# EAGLE schematic Driver (EAGLE 7.2.0)
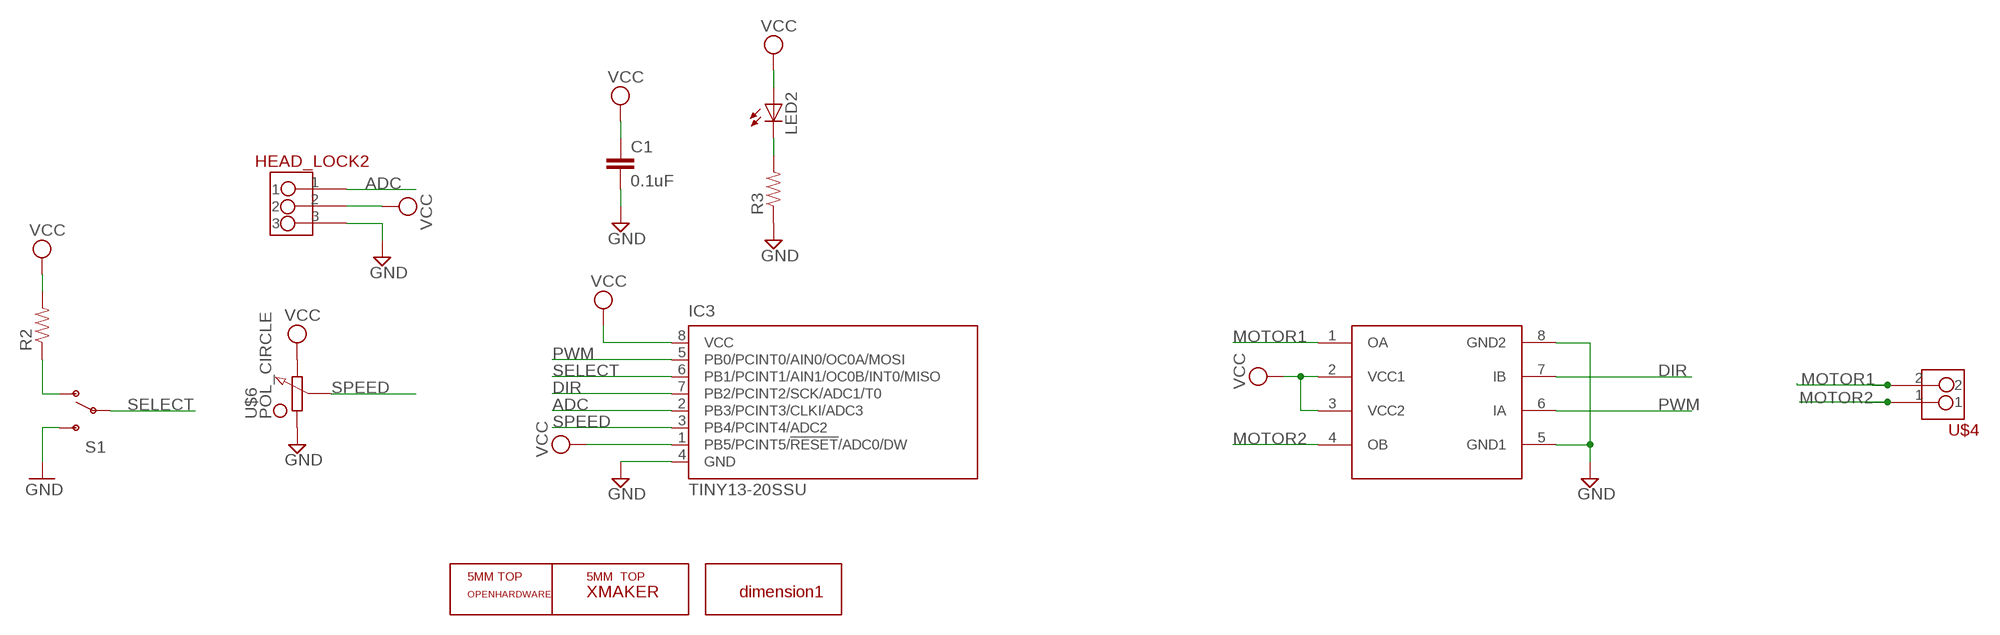
[diagram p0: schematic, sheet 1]

## Parts
C1  0.1uF  CAP0603-CAP  [0603-CAP]
HEAD_LOCK2  HEAD_LOCK  [HEAD_LOCK]
IC3  TINY13-20SSU  [8S1]
LED2  LED_ESML0603  [LED_SML0603]
R2  RESISTOR0603-RES  [0603-RES]
R3  0.27OHM-1/10W-1%(0603)  [0603-RES]
S1  SWITCH-SPDTKIT  [SWITCH-SPDT_KIT]
U$1  DIMENSION1  [DIMENSION1]
U$2  L9110  [SOP8]
U$4  HEAD_LOCK2  [HEAD_LOCK2]
U$6  POL_CIRCLE  [POT_CIRCLE]
U$7  XMAKERLOGO_5MM_TOP  [XMAKERLOGO_5MM_TOP]
U$8  OPENHARDWARE_5MM_TOP  [OPENSOURCE_5MM_TOP]

## Nets
ADC: HEAD_LOCK2.1 IC3.2(PB3/PCINT3/CLKI/ADC3)
DIR: IC3.7(PB2/PCINT2/SCK/ADC1/T0) U$2.7(IB)
GND: C1.2 HEAD_LOCK2.3 IC3.4(GND) R3.1 S1.3(S) U$2.5(GND1) U$2.8(GND2) U$6.P$3
MOTOR1: U$2.1(OA) U$4.2
MOTOR2: U$2.4(OB) U$4.1
N$2: R2.1 S1.1(O)
N$5: LED2.C R3.2
PWM: IC3.5(PB0/PCINT0/AIN0/OC0A/MOSI) U$2.6(IA)
SELECT: IC3.6(PB1/PCINT1/AIN1/OC0B/INT0/MISO) S1.2(P)
SPEED: IC3.3(PB4/PCINT4/ADC2) U$6.P$2
VCC: C1.1 HEAD_LOCK2.2 IC3.1(PB5/PCINT5/!RESET!/ADC0/DW) IC3.8(VCC) LED2.A R2.2 U$2.2(VCC1) U$2.3(VCC2) U$6.P$1

## Library data of the parts
C1 = SparkFun-Passives:CAP: Capacitor Standard 0603 ceramic capacitor, and 0.1" leaded capacitor.
HEAD_LOCK2 = Xmaker:HEAD_LOCK
IC3 = atmel:TINY13: 8-bit AVR Microcontroller with 1K Bytes In-System Programmable Flash Source: http://www.atmel.com/dyn/resources/prod_documents/2535S.pdf; MPN: ATTINY13-20SSU; OC_FARNELL: 1455133; OC_NEWARK: 58M3771
LED2 = eagle-ltspice:LED_E: LED Source: http://www.osram.convergy.de Source: www.luxeon.com Source: www.kingbright.com; SPICEMODEL: NONE; SPICEPREFIX: D; SPICETYPE: diode
R2 = SparkFun-Passives:RESISTOR: Resistor Basic schematic elements and footprints for 0603, 1206, and PTH resistors.
R3 = SparkFun-Resistors:0.27OHM-1/10W-1%(0603): RES-08787; PROD_ID: RES-08787
S1 = SparkFun-Electromechanical:SWITCH-SPDT: SPDT Switch Simple slide switch, Spark Fun Electronics SKU : COM-00102 DPDT SMT slide switch, AYZ0202, SWCH-08179; PROD_ID: SWCH-08261
U$1 = Xmaker_yuhui:DIMENSION1
U$2 = Xmaker_yuhui:L9110
U$4 = Xmaker:HEAD_LOCK2
U$6 = Xmaker_yuhui:POL_CIRCLE
U$7 = Xmaker_yuhui:XMAKERLOGO_5MM_TOP
U$8 = Xmaker_yuhui:OPENHARDWARE_5MM_TOP